# EAGLE design VSAB_75R_P (EAGLE 9.6.1)
Assembly variants: Plain
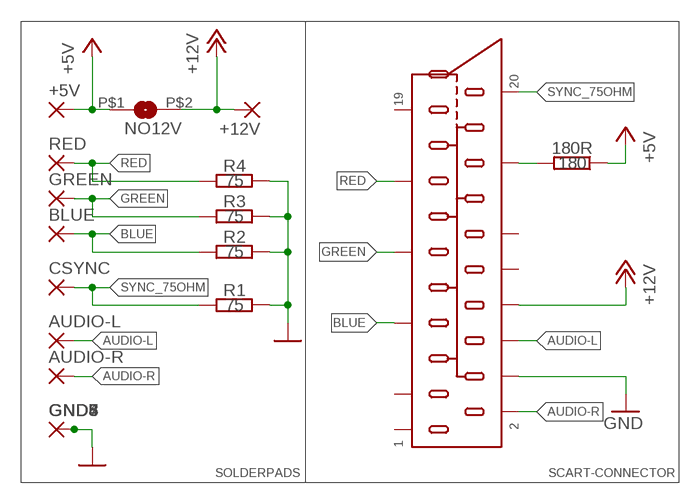
[diagram p0: schematic, sheet 1]

## Parts
180R  180  R-EU_R0805  [R0805]
+5V  WIREPADSMD5-1,8  [5-1,8]
+12V  WIREPADSMD5-1,8  [5-1,8]
AUDIO-L  WIREPADSMD5-1,8  [5-1,8]
AUDIO-R  WIREPADSMD5-1,8  [5-1,8]
BLUE  WIREPADSMD5-1,8  [5-1,8]
CSYNC  WIREPADSMD5-1,8  [5-1,8]
GND  WIREPADSMD5-1,8  [5-1,8]
GND3  WIREPADSMD5-1,8  [5-1,8]
GND4  WIREPADSMD5-1,8  [5-1,8]
GND5  WIREPADSMD5-1,8  [5-1,8]
GND6  WIREPADSMD5-1,8  [5-1,8]
GND7  WIREPADSMD5-1,8  [5-1,8]
GND8  WIREPADSMD5-1,8  [5-1,8]
GREEN  WIREPADSMD5-1,8  [5-1,8]
NO12V  MY_JUMPER  [MYJUMP]
R1  75  R-EU_R0805  [R0805]
R2  75  R-EU_R0805  [R0805]
R3  75  R-EU_R0805  [R0805]
R4  75  R-EU_R0805  [R0805]
RED  WIREPADSMD5-1,8  [5-1,8]
U$2  SCART_PLUG  [SCART]

## Nets
+5V: 180R.1 +5V.1(P) NO12V.P$1
+5V': 180R.2 U$2.16(AV/RGB_SW)
+12V: +12V.1(P) NO12V.P$2 U$2.8(TV/AV_SW)
AUDIO-L: AUDIO-L.1(P) U$2.6(AUDIO_IN_L)
AUDIO-R: AUDIO-R.1(P) U$2.2(AUDIO_IN_R)
BLUE: BLUE.1(P) R2.2 U$2.7(RGB_BLUE/YUV_V/PB)
GND [supply]: GND3.1(P) GND4.1(P) GND5.1(P) GND6.1(P) GND7.1(P) GND8.1(P) GND.1(P) R1.1 R2.1 R3.1 R4.1 U$2.4(GND) U$2.5(GND) U$2.9(GND) U$2.13(GND) U$2.14(GND) U$2.17(GND) U$2.18(GND)
GREEN: GREEN.1(P) R3.2 U$2.11(RGB_GREEN/YUV-Y)
RED: R4.2 RED.1(P) U$2.15(RGB_RED/YUV-U/PR/CHROMA)
SYNC_75OHM: CSYNC.1(P) R1.2 U$2.20(COMP/SYNC/LUMA_IN)
Unconnected: U$2.1(ADUIO_OUT_R) U$2.3(AUDIO_OUT_L) U$2.10(D2B_IN) U$2.12(D2B_OUT) U$2.19(COMP/SNYC/LUMA_OUT)

## Notes on the sheet
- SOLDERPADS | SCART-CONNECTOR

## Library data of the parts
180R R1-R4 = rcl:R-EU_: RESISTOR, European symbol; SPICEPREFIX: R
+5V +12V AUDIO-L AUDIO-R BLUE CSYNC GND GND3-GND8 GREEN RED = wirepad:WIREPAD: Wire PAD connect wire on PCB
NO12V = snes_div:MY_JUMPER
U$2 = VSAB_lib:SCART_PLUG

## Net classes
1 supply: width 1.016 mm, clearance 0.254 mm

## Board
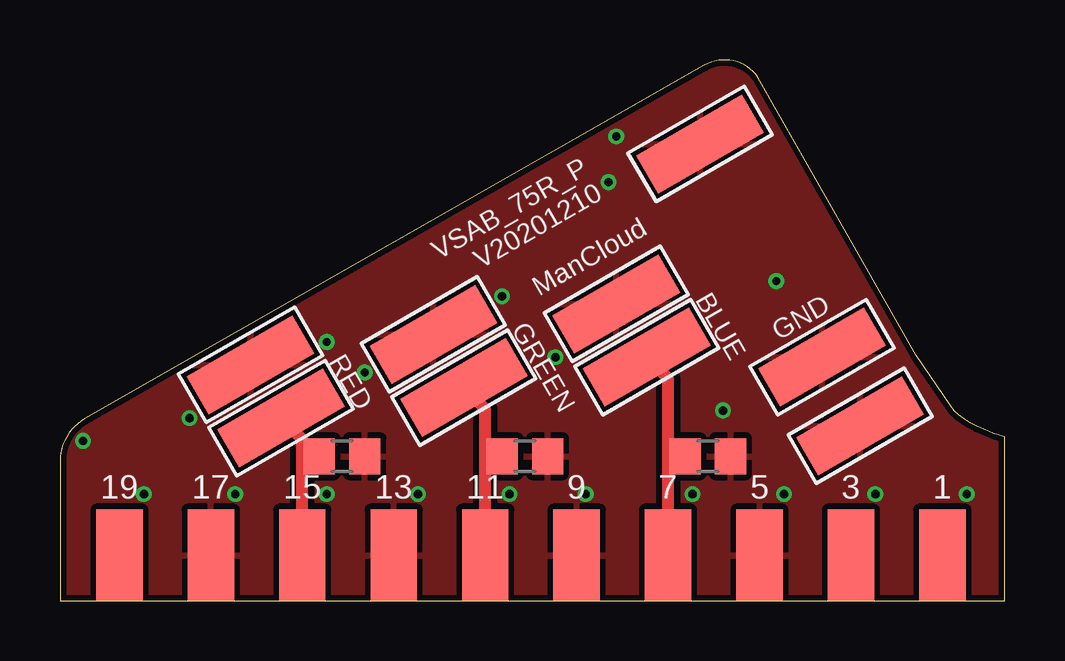
[diagram p1: board, top side]
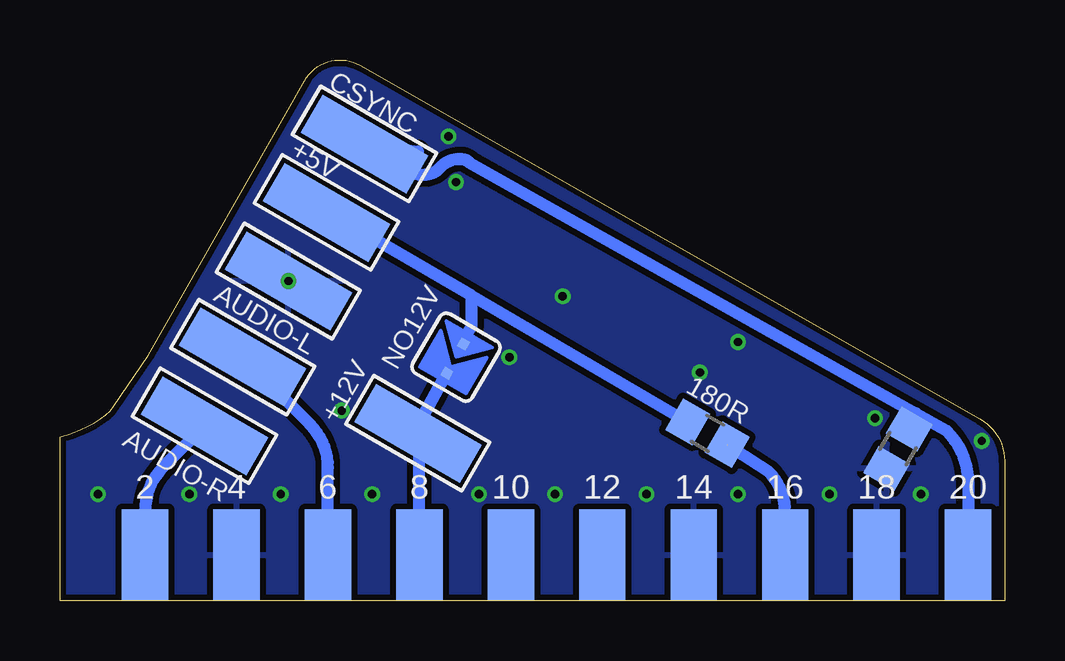
[diagram p2: board, bottom side, seen from below]

Size 39.36 x 22.55 mm. Coordinates in mm from the lower left corner, seen from the top.
Outline: 39.36,6.84 38.89,6.98 38.51,7.15 38.22,7.27 37.93,7.42 37.67,7.59 37.45,7.75 37.26,7.92 37.12,8.12 35.69,10.23 29.16,21.7 arc90 26.85,22.33 1.02,7.58 arc60 0,5.83 0,0 39.36,0 39.36,6.84
Copper layers (1*16): Top 0.035mm / dielectric 1.5mm / Bottom 0.035mm
Design rules "ITEADstudio_DRC *": minimum track width 6mil, minimum drill 0.2mm, track to track 6mil, track to pad 6mil, pad to pad 6mil, via to via 6mil, smd to smd 0mil, copper to edge 10mil, drill to drill 10mil, minimum pad ring 10mil, minimum via ring 6mil, stop-mask expansion 2mil, vias tented up to drill 100mil, thermal gap 10mil

### Footprints (pad centres in the part's own frame; a part is rotated, then mirrored left to right if it is on the bottom)
R0805 = smd 1.3 x 1.5: 1 -0.95,0; 2 0.95,0
5-1,8 = smd 1.829 x 5.08: 1 0,0
MYJUMP = smd 0.406 x 0.406: P$1 -0.635,0; P$2 0.765,0
SCART = smd 1.93 x 3.81: 1 16.192,1.905; 3 12.383,1.905; 5 8.572,1.905; 7 4.763,1.905; 9 0.953,1.905; 11 -2.857,1.905; 13 -6.668,1.905; 15 -10.477,1.905; 17 -14.287,1.905; 19 -18.098,1.905 | smd 1.93 x 3.81 bottom: 2 15.24,1.905; 4 11.43,1.905; 6 7.62,1.905; 8 3.81,1.905; 10 0,1.905; 12 -3.81,1.905; 14 -7.62,1.905; 16 -11.43,1.905; 18 -15.24,1.905; 20 -19.05,1.905

### Placement (x,y rotation side)
180R  12.38,6.99 330 bottom
+5V  28.26,16.19 240 bottom
+12V  24.45,6.99 60 bottom
AUDIO-L  31.75,10.16 240 bottom
AUDIO-R  33.34,7.3 240 bottom
BLUE  24.45,10.16 120 top
CSYNC  26.67,19.05 240 bottom
GND  31.75,10.16 120 top
GND3  23.18,12.38 120 top
GND4  15.56,11.11 120 top
GND5  7.94,9.84 120 top
GND6  33.34,7.3 120 top
GND7  26.67,19.05 300 top
GND8  29.84,13.34 60 bottom
GREEN  16.83,8.89 300 top
NO12V  22.86,10.16 240 bottom
R1  4.45,6.35 60 bottom
R2  26.99,6.03 180 top
R3  19.37,6.03 180 top
R4  11.75,6.03 180 top
RED  9.21,7.62 120 top
U$2  20.57,0 0 top

### Tracks (layer width: path | path; a pad name or v marks a point on that pad's centre or on a via)
+5V
  Bottom 0.152: 28.13,16.19 +5V.1
  Bottom 0.508: 28.13,16.19 22.21,12.73 | 22.21,12.73 180R.1 | NO12V.P$1 22.54,10.9 22.21,11.45 22.21,12.73
+5V'  (1 unrouted)
  Bottom 0.508: 180R.2 9.84,5.4 arc45 9.14,3.71 U$2.16
+12V
  Bottom 0.508: NO12V.P$2 24.33,7.52 +12V.1 24.38,6.92 U$2.8
AUDIO-L
  Bottom 0.508: U$2.6 28.19,5.55 arc-45 28.94,7.35 AUDIO-L.1
AUDIO-R
  Bottom 0.508: AUDIO-R.1 35.07,5.57 arc-45 35.81,3.77 U$2.2
BLUE
  Top 0.152: R2.2 25.65,6.03 25.34,5.71
  Top 0.508: U$2.7 25.34,5.71 25.34,9.27 BLUE.1
GND  (via drill 0.35 pad 0.2)
  other vias: 0.95,6.67 3.49,4.45 7.3,4.45 11.11,4.45 14.92,4.45 18.73,4.45 21.91,4.45 26.35,4.45 30.16,4.45 33.97,4.45 37.78,4.45 20.64,10.16 27.62,7.94 12.7,9.53 11.11,10.79 18.41,12.7 29.84,13.34 22.86,17.46 23.18,19.37 5.4,7.62
  pour Top: -1.27,-1.27 -1.27,8.89 25.4,24.13 30.48,24.13 39.37,10.16 41.91,8.89 41.91,-1.27
  pour Bottom: -1.27,-1.27 -1.27,8.89 25.4,24.13 30.48,24.13 39.37,10.16 41.91,8.89 41.91,-1.27
GREEN
  Top 0.152: R3.2 18.03,6.03 17.72,5.71
  Top 0.508: U$2.11 17.72,5.71 17.72,8 GREEN.1
RED
  Top 0.152: R4.2 10.48,5.71 10.1,5.71
  Top 0.508: U$2.15 10.1,5.71 10.1,6.73 RED.1
SYNC_75OHM
  Bottom 0.508: 24.45,18.73 CSYNC.1 26.56,19.05 24.45,17.78 24.13,17.78 arc-45 23.59,18 23.5,18.1 arc45 22.73,18.41 22.63,18.41 arc45 22.3,18.28 | 3.7,7.82 2.43,7.1 arc45 1.52,4.92 U$2.20 | 3.7,7.82 22.3,18.28 | 22.3,18.28 22.54,18.41 | R1.2 3.7,7.44 3.7,7.82

### Text on the board
tPlace: VSAB_75R_P / V20201210 | ManCloud